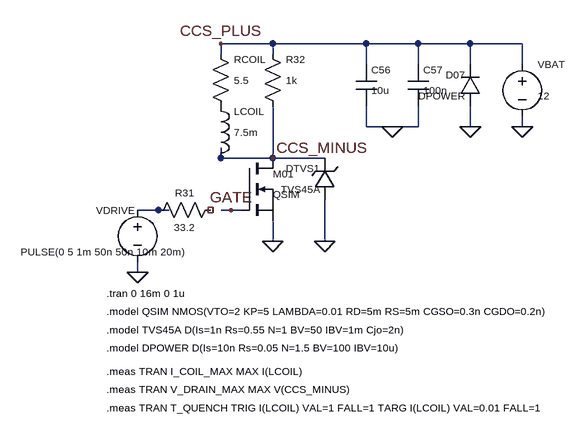
[diagram p0: schematic pyppm_12v_polarizer_graphical.asc]
pyppm_12v_polarizer_graphical.asc, the LTspice schematic file:
Version 4
SHEET 1 960 640
WIRE 208 80 288 80
WIRE 288 80 432 80
WIRE 432 80 512 80
WIRE 512 80 592 80
WIRE 592 80 672 80
WIRE 208 80 208 96
WIRE 288 80 288 96
WIRE 432 80 432 112
WIRE 512 80 512 112
WIRE 592 80 592 112
WIRE 672 80 672 112
WIRE 432 176 432 208
WIRE 512 176 512 208
WIRE 432 208 512 208
WIRE 592 176 592 208
WIRE 672 192 672 208
WIRE 208 240 208 256
WIRE 288 176 288 256
WIRE 208 256 288 256
WIRE 288 256 368 256
WIRE 80 336 128 336
WIRE 208 336 240 336
WIRE 80 416 80 432
WIRE 288 352 288 384
WIRE 368 320 368 384
FLAG 208 80 CCS_PLUS
FLAG 288 256 CCS_MINUS
FLAG 80 432 0
FLAG 224 336 GATE
FLAG 288 384 0
FLAG 368 384 0
FLAG 472 208 0
FLAG 592 208 0
FLAG 672 208 0
SYMBOL voltage 80 320 R0
WINDOW 0 -64 16 Left 1
WINDOW 3 -180 80 Left 1
SYMATTR InstName VDRIVE
SYMATTR Value PULSE(0 5 1m 50n 50n 10m 20m)
SYMBOL res 208 320 R90
WINDOW 0 0 56 VBottom 1
WINDOW 3 32 56 VTop 1
SYMATTR InstName R31
SYMATTR Value 33.2
SYMBOL res 192 80 R0
WINDOW 0 36 24 Left 1
WINDOW 3 36 56 Left 1
SYMATTR InstName RCOIL
SYMATTR Value 5.5
SYMBOL ind 192 160 R0
WINDOW 0 36 24 Left 1
WINDOW 3 36 56 Left 1
SYMATTR InstName LCOIL
SYMATTR Value 7.5m
SYMBOL res 272 80 R0
WINDOW 0 36 24 Left 1
WINDOW 3 36 56 Left 1
SYMATTR InstName R32
SYMATTR Value 1k
SYMBOL nmos 240 256 R0
WINDOW 0 48 24 Left 1
WINDOW 3 48 56 Left 1
SYMATTR InstName M01
SYMATTR Value QSIM
SYMBOL zener 384 320 R180
WINDOW 0 24 48 Left 1
WINDOW 3 24 16 Left 1
SYMATTR InstName DTVS1
SYMATTR Value TVS45A
SYMBOL cap 416 112 R0
WINDOW 0 24 8 Left 1
WINDOW 3 24 40 Left 1
SYMATTR InstName C56
SYMATTR Value 10u
SYMBOL cap 496 112 R0
WINDOW 0 24 8 Left 1
WINDOW 3 24 40 Left 1
SYMATTR InstName C57
SYMATTR Value 100n
SYMBOL diode 608 176 R180
WINDOW 0 24 48 Left 1
WINDOW 3 24 16 Left 1
SYMATTR InstName D07
SYMATTR Value DPOWER
SYMBOL voltage 672 96 R0
WINDOW 0 24 16 Left 1
WINDOW 3 24 64 Left 1
SYMATTR InstName VBAT
SYMATTR Value 12
TEXT 32 464 Left 1 !.tran 0 16m 0 1u
TEXT 32 492 Left 1 !.model QSIM NMOS(VTO=2 KP=5 LAMBDA=0.01 RD=5m RS=5m CGSO=0.3n CGDO=0.2n)
TEXT 32 520 Left 1 !.model TVS45A D(Is=1n Rs=0.55 N=1 BV=50 IBV=1m Cjo=2n)
TEXT 32 548 Left 1 !.model DPOWER D(Is=10n Rs=0.05 N=1.5 BV=100 IBV=10u)
TEXT 32 584 Left 1 !.meas TRAN I_COIL_MAX MAX I(LCOIL)
TEXT 32 612 Left 1 !.meas TRAN V_DRAIN_MAX MAX V(CCS_MINUS)
TEXT 32 640 Left 1 !.meas TRAN T_QUENCH TRIG I(LCOIL) VAL=1 FALL=1 TARG I(LCOIL) VAL=0.01 FALL=1

The netlist it stands for:
* pyppm_12v_polarizer_graphical.asc
VDRIVE N001 0 PULSE(0 5 1m 50n 50n 10m 20m)
R31 NC_01 N001 33.2
RCOIL CCS_PLUS P001 5.5
LCOIL P001 CCS_MINUS 7.5m
R32 CCS_PLUS CCS_MINUS 1k
M01 CCS_MINUS GATE 0 0 QSIM
DTVS1 0 CCS_MINUS TVS45A
C56 CCS_PLUS 0 10u
C57 CCS_PLUS 0 100n
D07 0 CCS_PLUS DPOWER
VBAT CCS_PLUS 0 12
.model D D
.lib standard.dio
.model NMOS NMOS
.model PMOS PMOS
.lib standard.mos
.tran 0 16m 0 1u
.model QSIM NMOS(VTO=2 KP=5 LAMBDA=0.01 RD=5m RS=5m CGSO=0.3n CGDO=0.2n)
.model TVS45A D(Is=1n Rs=0.55 N=1 BV=50 IBV=1m Cjo=2n)
.model DPOWER D(Is=10n Rs=0.05 N=1.5 BV=100 IBV=10u)
.meas TRAN I_COIL_MAX MAX I(LCOIL)
.meas TRAN V_DRAIN_MAX MAX V(CCS_MINUS)
.meas TRAN T_QUENCH TRIG I(LCOIL) VAL=1 FALL=1 TARG I(LCOIL) VAL=0.01 FALL=1
.backanno
.end